# Altium schematic sheet LDO.SchDoc
size A4; SheetNumber: 7; SheetTotal: 7
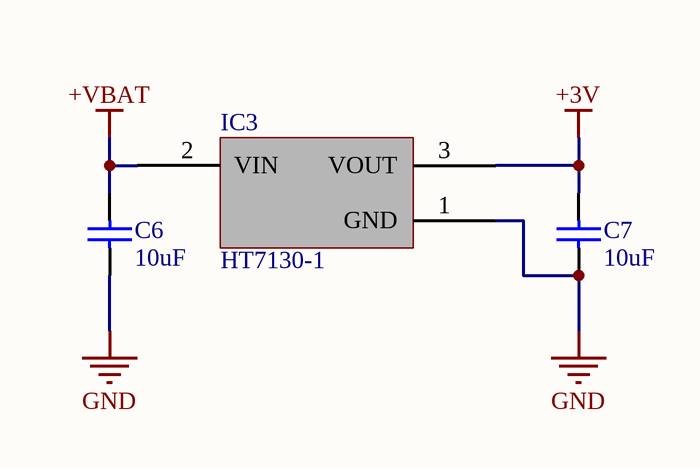
[diagram p0: LDO.SchDoc]

## Parts
C6  value 10uF  [Wurth 0603 capacitor]  (hidden comment: Generic Capacitor 10uF 0603)
C7  value 10uF  [Wurth 0603 capacitor]  (hidden comment: Generic Capacitor 10uF 0603)
IC3  HT7130-1  [UMW SOT89-3]

## Nets
+3V: C7.2 IC3.3(VOUT)
+VBAT: C6.2 IC3.2(VIN)
GND: C6.1 C7.1 IC3.1(GND)

## Library data of the parts
IC3 = UMW HT7130-1: HOLTEK   HT7130-1-SOT89TRLF   Fixed LDO Voltage Regulator, 4V to 24V, 100mV Dropout, 3Vout, 30mAout, SOT-89-3; Supplier: Newark; Supplier Part Number: 53M7841; Manufacturer: Holtek; Manufacturer Part Number: HT7130-1-SOT89TRLF; RoHS: Yes; Category: Voltage Regulators - Linear; Stock: 2; Pricing: 1=0,143, 10=0,143, 25=0,143, 50=0,143, 100=0,143, 250=0,143, 500=0,143, 1000=0,143 (USD); ComponentLink1URL: https://datasheet.ciiva.com/1511/79203-1511505.pdf?src-supplier=Element14; ComponentLink1Description: https://datasheet.ciiva.com/1511/79203-1511505.pdf?src-supplier=Element14